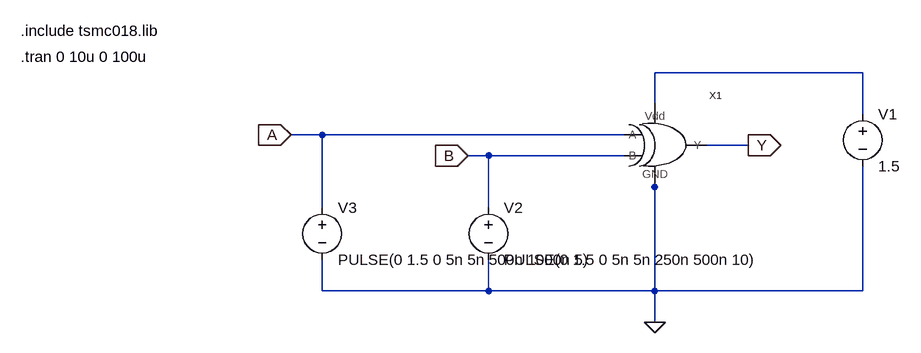
[diagram p0: schematic xor_cmos_tb.asc]
xor_cmos_tb.asc, the LTspice schematic file:
Version 4
SHEET 1 880 680
WIRE 544 80 224 80
WIRE 224 128 224 80
WIRE 544 144 544 80
WIRE -288 176 -336 176
WIRE 176 176 -288 176
WIRE 368 192 304 192
WIRE -32 208 -64 208
WIRE 176 208 -32 208
WIRE 224 256 224 240
WIRE -288 288 -288 176
WIRE -32 288 -32 208
WIRE -288 416 -288 368
WIRE -32 416 -32 368
WIRE -32 416 -288 416
WIRE 224 416 224 256
WIRE 224 416 -32 416
WIRE 544 416 544 224
WIRE 544 416 224 416
WIRE 224 464 224 416
FLAG 224 464 0
FLAG 368 192 Y
IOPIN 368 192 Out
FLAG -336 176 A
IOPIN -336 176 In
FLAG -64 208 B
IOPIN -64 208 In
SYMBOL xor_cmos 192 160 R0
SYMATTR InstName X1
SYMBOL voltage 544 128 R0
WINDOW 123 0 0 Left 0
WINDOW 39 0 0 Left 0
SYMATTR InstName V1
SYMATTR Value 1.5
SYMBOL voltage -32 272 R0
WINDOW 123 0 0 Left 0
WINDOW 39 0 0 Left 0
SYMATTR InstName V2
SYMATTR Value PULSE(0 1.5 0 5n 5n 250n 500n 10)
SYMBOL voltage -288 272 R0
WINDOW 123 0 0 Left 0
WINDOW 39 0 0 Left 0
SYMATTR InstName V3
SYMATTR Value PULSE(0 1.5 0 5n 5n 500n 1000n 5)
TEXT -752 16 Left 2 !.include tsmc018.lib
TEXT -752 56 Left 2 !.tran 0 10u 0 100u

The netlist it stands for:
* xor_cmos_tb.asc
XX1 Y N001 0 A B xor_cmos  ; pins Y Vdd GND A B
V1 N001 0 1.5
V2 B 0 PULSE(0 1.5 0 5n 5n 250n 500n 10)
V3 A 0 PULSE(0 1.5 0 5n 5n 500n 1000n 5)
.include tsmc018.lib
.tran 0 10u 0 100u
.backanno
.end